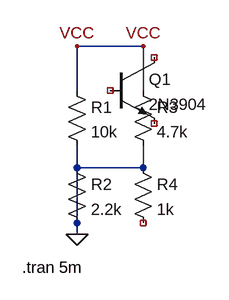
[diagram p0: schematic common_emitter.asc]
common_emitter.asc, the LTspice schematic file:
Version 4
SHEET 1 880 680
WIRE 208 128 112 128
WIRE 112 192 112 128
WIRE 208 192 208 128
WIRE 112 304 112 272
WIRE 208 304 208 272
WIRE 208 304 112 304
WIRE 112 400 112 304
SYMBOL npn 160 144 R0
SYMATTR InstName Q1
SYMATTR Value 2N3904
SYMBOL res 96 176 R0
SYMATTR InstName R1
SYMATTR Value 10k
SYMBOL res 96 288 R0
SYMATTR InstName R2
SYMATTR Value 2.2k
SYMBOL res 192 176 R0
SYMATTR InstName R3
SYMATTR Value 4.7k
SYMBOL res 192 288 R0
SYMATTR InstName R4
SYMATTR Value 1k
FLAG 208 128 VCC
FLAG 112 400 0
FLAG 112 128 VCC
TEXT 32 448 Left 2 !.tran 5m

The netlist it stands for:
* common_emitter.asc
Q1 NC_01 NC_02 NC_03 0 2N3904
R1 VCC 0 10k
R2 0 0 2.2k
R3 VCC 0 4.7k
R4 0 NC_04 1k
.model NPN NPN
.model PNP PNP
.lib standard.bjt
.tran 5m
.backanno
.end